# Altium project Mini RFDx900 Board V0.PrjPcb
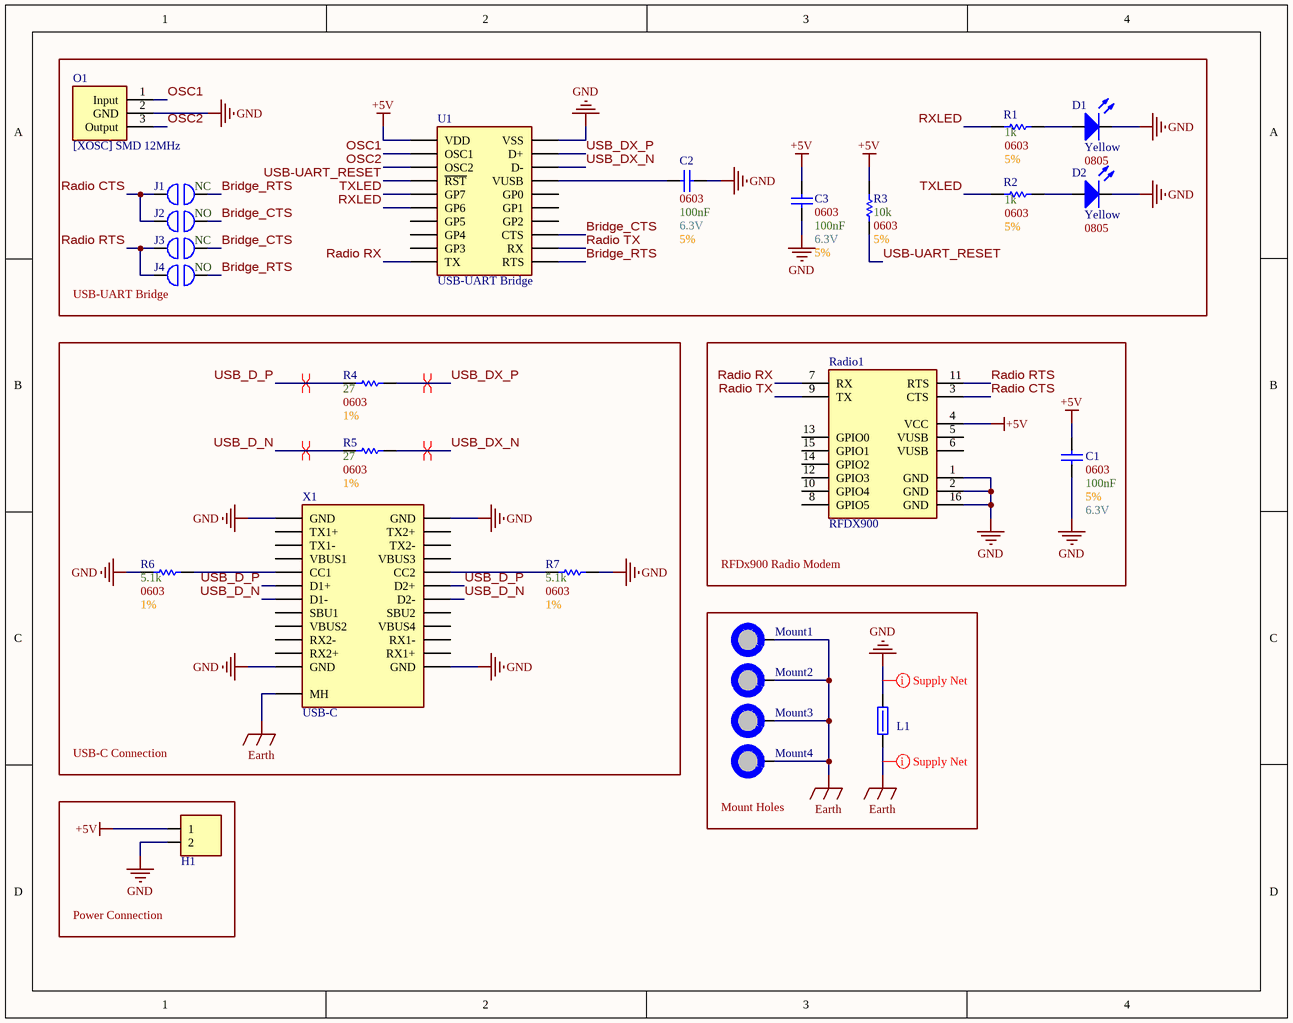
[diagram p0: Main.SchDoc]
1 sheet, 26 parts. Net scope: global (net labels, ports and power ports of the same name join across sheets).
Board file: Main.PcbDoc

## Sheet Main.SchDoc
size A; SheetNumber: 1; SheetTotal: 1

### Parts
C1  Size Package: 0603  Capacitance: 100nF  Voltage: 6.3V  Tolerance: 5%  [[Cap] SMD 0603]  (hidden comment: [Cap] SMD Nonpolarized)
C2  Size Package: 0603  Capacitance: 100nF  Voltage: 6.3V  Tolerance: 5%  [[Cap] SMD 0603]  (hidden comment: [Cap] SMD Nonpolarized)
C3  Size Package: 0603  Capacitance: 100nF  Voltage: 6.3V  Tolerance: 5%  [[Cap] SMD 0603]  (hidden comment: [Cap] SMD Nonpolarized)
D1  Color: Yellow  Size Package: 0805  [[LED] SMD 0805]  (hidden comment: SMD LED)
D2  Color: Yellow  Size Package: 0805  [[LED] SMD 0805]  (hidden comment: SMD LED)
H1  1x2 Male  [[Header] Shrouded 1x2 Male]  (value not drawn)
J1  NO/NC: NC  [[Jumper] Solderable Jumper]  (hidden comment: [Jump] SMD Jumper)  (no BOM)
J2  NO/NC: NO  [[Jumper] Solderable Jumper]  (hidden comment: [Jump] SMD Jumper)  (no BOM)
J3  NO/NC: NC  [[Jumper] Solderable Jumper]  (hidden comment: [Jump] SMD Jumper)  (no BOM)
J4  NO/NC: NO  [[Jumper] Solderable Jumper]  (hidden comment: [Jump] SMD Jumper)  (no BOM)
L1  652-MH2029-300Y  [[Ferrite] SMD Bead 0805 (1)]  (value not drawn)
Mount1  M3 Mount Hole  [[Mount] M3 Mount Hole]  (value not drawn)  (no BOM)
Mount2  M3 Mount Hole  [[Mount] M3 Mount Hole]  (value not drawn)  (no BOM)
Mount3  M3 Mount Hole  [[Mount] M3 Mount Hole]  (value not drawn)  (no BOM)
Mount4  M3 Mount Hole  [[Mount] M3 Mount Hole]  (value not drawn)  (no BOM)
O1  [XOSC] SMD 12MHz  [[XOSC] SMD 12MHz]
R1  Resistance: 1k  Size Package: 0603  Tolerance: 5%  [[Res] SMD 0603]  (hidden comment: [Res] SMD Resistor)
R2  Resistance: 1k  Size Package: 0603  Tolerance: 5%  [[Res] SMD 0603]  (hidden comment: [Res] SMD Resistor)
R3  Resistance: 10k  Size Package: 0603  Tolerance: 5%  [[Res] SMD 0603]  (hidden comment: [Res] SMD Resistor)
R4  Tolerance: 1%  Resistance: 27  Size Package: 0603  [[Res] SMD 0603]  (hidden comment: [Res] SMD Resistor)
R5  Tolerance: 1%  Resistance: 27  Size Package: 0603  [[Res] SMD 0603]  (hidden comment: [Res] SMD Resistor)
R6  Tolerance: 1%  Resistance: 5.1k  Size Package: 0603  [[Res] SMD 0603]  (hidden comment: [Res] SMD Resistor)
R7  Tolerance: 1%  Resistance: 5.1k  Size Package: 0603  [[Res] SMD 0603]  (hidden comment: [Res] SMD Resistor)
Radio1  RFDX900  [[Device] RFDX900 Radio SMD Mount]
U1  USB-UART Bridge  [[IC] USB-UART Bridge]
X1  USB-C  [[Port] USB-C]

### Blocks framed on the sheet
USB-UART Bridge: C2 C3 D1 D2 J1-J4 O1 R1-R3 U1
USB-C Connection: R4-R7 X1
RFDx900 Radio Modem: C1 Radio1
Mount Holes: L1 Mount1-Mount4
Power Connection: H1

### Nets
+5V: C1.2 C3.2 H1.1 R3.2 Radio1.4(VCC) U1.1(VDD)
Earth: L1.1 Mount1.1 Mount2.1 Mount3.1 Mount4.1 X1.MH
GND: C1.1 C2.1 C3.1 D1.2(Cathode) D2.2(Cathode) H1.2 L1.2 O1.2(GND) R6.1 R7.2 Radio1.1(GND) Radio1.2(GND) Radio1.16(GND) U1.20(VSS) X1.A1(GND) X1.A12(GND) X1.B1(GND) X1.B12(GND)
Bridge_CTS: J2.2 J3.2 U1.13(CTS)
Bridge_RTS: J1.2 J4.2 U1.11(RTS)
OSC1: O1.1(Input) U1.2(OSC1)
OSC2: O1.3(Output) U1.3(OSC2)
Radio CTS: J1.1 J2.1 Radio1.3(CTS)
Radio RTS: J3.1 J4.1 Radio1.11(RTS)
Radio RX: Radio1.7(RX) U1.10(TX)
Radio TX: Radio1.9(TX) U1.12(RX)
RXLED: R1.2 U1.6(GP6)
TXLED: R2.2 U1.5(GP7)
USB-UART_RESET: R3.1 U1.4(~{RST})
USB_D_N: R5.1 X1.A7(D1-) X1.B7(D2-)
USB_D_P: R4.1 X1.A6(D1+) X1.B6(D2+)
USB_DX_N: R5.2 U1.18(D-)
USB_DX_P: R4.2 U1.19(D+)
NetC2_2: C2.2 U1.17(VUSB)
NetD1_1: D1.1(Anode) R1.1
NetD2_1: D2.1(Anode) R2.1
NetR6_2: R6.2 X1.A5(CC1)
NetR7_1: R7.1 X1.B5(CC2)

Not connected (* = marked no-connect by the designer): Radio1 5(VUSB) 6(VUSB) 8(GPIO5) 10(GPIO4) 12(GPIO3) 13(GPIO0) 14(GPIO2) 15(GPIO1); U1 7(GP5) 8(GP4) 9(GP3) 14(GP2) 15(GP1) 16(GP0); X1 A2(TX1+) A3(TX1-) A4(VBUS1) A8(SBU1) A9(VBUS2) A10(RX2-) A11(RX2+) B2(TX2+) B3(TX2-) B4(VBUS3) B8(SBU2) B9(VBUS4) B10(RX1-) B11(RX1+)

### Layout directives
differential pair; differential pair class USB_Pairs: USB_D_N, USB_D_P, USB_DX_N, USB_DX_P
net class Supply_Nets: Earth, GND

### Library data of the parts
D1 D2 = [LED] SMD: Generic; Part #: *; Supplier 1: DigiKey; Supplier Part Number 1: 3147-B1701UY--20D000214U1930CT-ND
H1 = [Header] Shrouded 1x2 Male: 0705430036 / Mates with 0050579402; Supplier 1: DigiKey; Supplier 2: DigiKey; Supplier Part Number 2: WM2900-ND; Supplier Part Number 1: WM4824-ND
J1-J4 = [Jump] SMD Jumper: Solderable jumper
L1 = [Ferrite] SMD Ferrite Bead (1): Res @ Freq: 30 @ 100MHz; Size Package: 0805
Mount1-Mount4 = [Mount] M3 Mount Hole: Place at least 4.5mm from board edge. Plated.
R1-R7 = [Res] SMD Resistor: Generic; Supplier 1: DigiKey
  R1 R2: Supplier Part Number 1: RMCF0603FT1K00DKR-ND
  R3: Supplier Part Number 1: 311-10.0KHRDKR-ND
  R4 R5: Supplier Part Number 1: 749-1631-1-ND
  R6 R7: Supplier Part Number 1: 311-5.10KHRDKR-ND
Radio1 = [Device] RFDX900 Radio: RFDX900 Long-Range RF Module; Supplier 1: DigiKey; Supplier Part Number 1: 609-71609-308LF-ND
U1 = [IC] USB-UART Bridge: MCP2200T-I/SO; Supplier 1: DigiKey; Supplier Part Number 1: MCP2200T-I/SOCT-ND
X1 = [Port] USB Type-C: Supplier 1: DigiKey; Supplier Part Number 1: 670-3104-1-ND
C1-C3 = [Cap] SMD Nonpolarized: Supplier 1: DigiKey; Supplier Part Number 1: 311-1088-6-ND
O1 = [XOSC] SMD 12MHz: Supplier 1: DigiKey; Supplier Part Number 1: 490-17947-1-ND